# EAGLE design sensors (EAGLE 7.2.0)
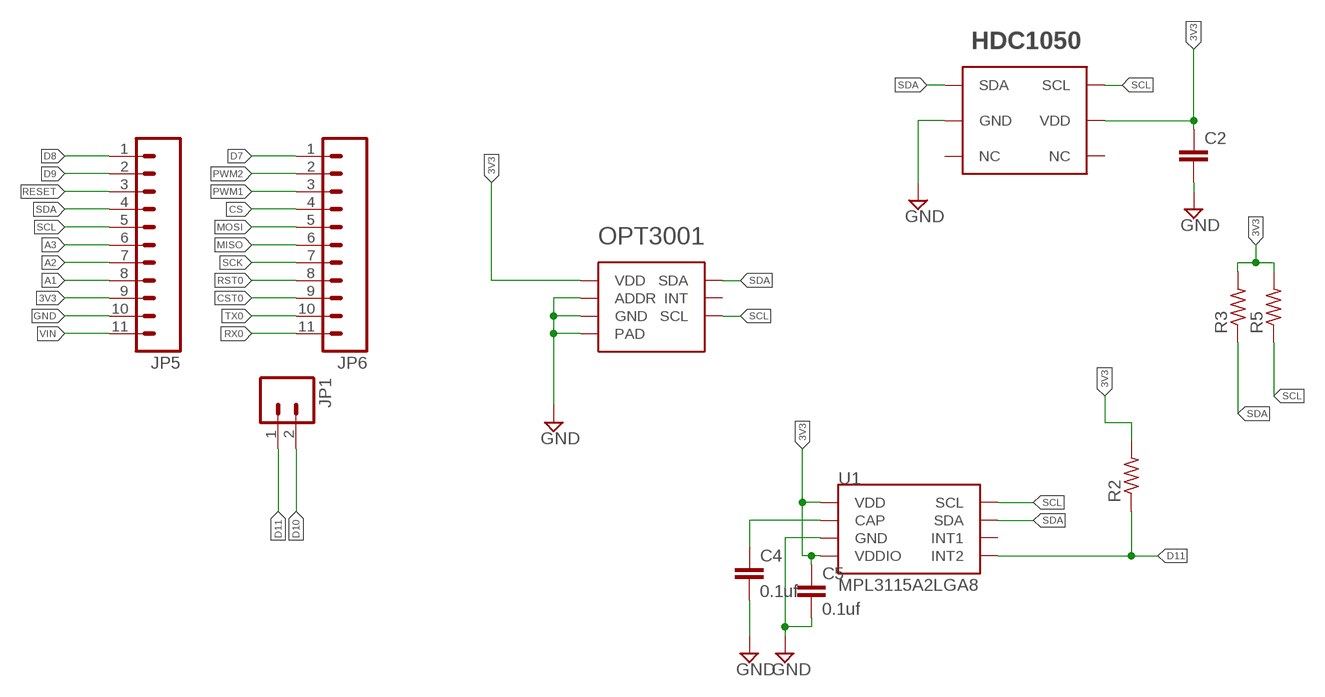
[diagram p0: schematic, sheet 1]

## Parts
C2  C-EUC0805  [C0805]
C4  0.1uf  C-EUC0805  [C0805]
C5  0.1uf  C-EUC0805  [C0805]
HDC1050  HDC1050  [PWSON-6]
JP1  M02PTH  [1X02]
JP5  M11PTH  [1X11]
JP6  M11PTH  [1X11]
OPT3001  OPT3001  [OPT3001]
R2  R-US_0204/5  [0204/5]
R3  R-US_0204/5  [0204/5]
R5  R-US_0204/5  [0204/5]
U1  MPL3115A2LGA8  [LGA8]

## Nets
3V3: C2.1 C5.1 HDC1050.P$5(VDD) JP5.9 OPT3001.P$1(VDD) R2.2 R3.2 R5.2 U1.1(VDD) U1.4(VDDIO)
A1: JP5.8
A2: JP5.7
A3: JP5.6
CS: JP6.4
CST0: JP6.9
D7: JP6.1
D8: JP5.1
D9: JP5.2
D10: JP1.2
D11: JP1.1 R2.1 U1.5(INT2)
GND: C2.2 C4.2 C5.2 HDC1050.P$2(GND) JP5.10 OPT3001.P$2(ADDR) OPT3001.P$3(GND) OPT3001.P$7(PAD) U1.3(GND)
MISO: JP6.6
MOSI: JP6.5
N$5: C4.1 U1.2(CAP)
PWM1: JP6.3
PWM2: JP6.2
RESET: JP5.3
RST0: JP6.8
RX0: JP6.11
SCK: JP6.7
SCL: HDC1050.P$6(SCL) JP5.5 OPT3001.P$4(SCL) R5.1 U1.8(SCL)
SDA: HDC1050.P$1(SDA) JP5.4 OPT3001.P$6(SDA) R3.1 U1.7(SDA)
TX0: JP6.10
VIN: JP5.11
Unconnected: HDC1050.P$3(NC) HDC1050.P$4(NC) OPT3001.P$5(INT) U1.6(INT1)

## Library data of the parts
C2 C4 C5 = rcl:C-EU: CAPACITOR, European symbol
HDC1050 = hdc1050:HDC1050: HDC1050 - Digital Humidity Sensor Technical Specifications: VCC: 2.7 - 5.5V Relative Humidity Accuracy ±3% Temperature Accuracy ±0.2°C Max Resolution: 14 bit Interface:I2C Operating Temperat ure: -40°C t o 125 °C Avg Current:710 nA @ 1sps, 11 bit RH Measurement 1.3 µA @ 1sps, 11 bit RH and Temperature 100 nA Sleep Mode Current
JP1 = SparkFun-Connectors:M02: Standard 2-pin 0.1" header. Use with - straight break away headers ( PRT-00116) - right angle break away headers (PRT-00553) - swiss pins (PRT-00743) - machine pins (PRT-00117) - female headers (PRT-00115) Molex polarized connector foot print use with: PRT-08233 with associated crimp pins and housings. 2.54_SCREWTERM for use with PRT-10571. 3.5mm Screw Terminal footprints for PRT-08084 5mm Screw Terminal footprints for use with PRT-08432
JP5 JP6 = SparkFun-Connectors:M11: Header 11 Standard 11-pin 0.1" header. Use with straight break away headers (SKU : PRT-00116), right angle break away headers (PRT-00553), swiss pins (PRT-00743), machine pins (PRT-00117), and female headers (PRT-00115).
OPT3001 = my_own:OPT3001: OPT3001-Ambient Light Sensor Technical Specifications: VDD: 1.6 to 3.6V 5.5V tolerant I/O Operating Temp: -40 to 85C Package: USON-6
R2 R3 R5 = resistor:R-US_: RESISTOR, American symbol
U1 = SparkFun-Sensors:MPL3115A2: Altimeter/Pressure Sensor, I2C, 1.95V-3.6V supply, 50 to 110kPa; PROD_ID: IC-10869

## Net classes
0 default: width 0.406 mm, drill 0.6 mm, clearance 0.305 mm

## Board
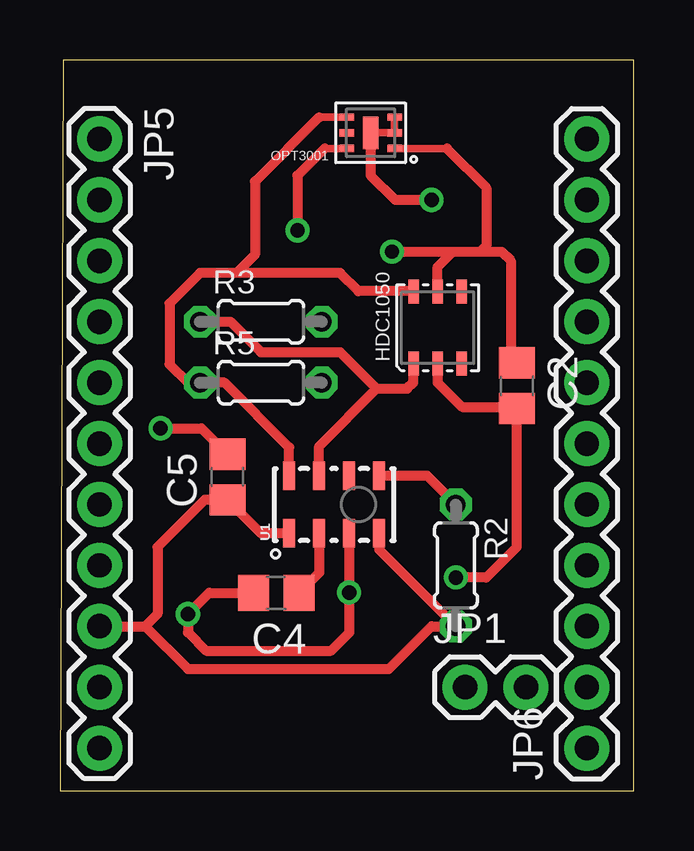
[diagram p1: board, top side]
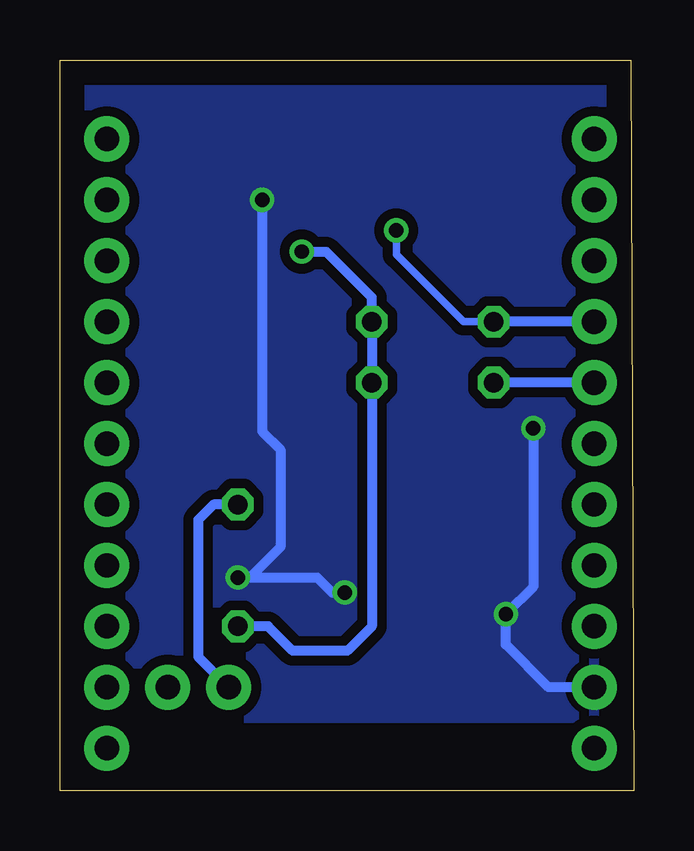
[diagram p2: board, bottom side, seen from below]

Size 23.93 x 30.47 mm. Coordinates in mm from the lower left corner, seen from the top.
Outline: 0,0 23.93,0 23.93,30.47 0.13,30.47 0,0
Copper layers (1*16): Top 0.035mm / dielectric 1.5mm / Bottom 0.035mm
Design rules "default": minimum track width 10mil, minimum drill 24mil, track to track 8mil, track to pad 8mil, pad to pad 8mil, via to via 8mil, smd to smd 8mil, copper to edge 40mil, drill to drill 8mil, minimum pad ring 10mil, minimum via ring 8mil, stop-mask expansion 4mil, vias tented up to drill 0mil, thermal gap 10mil

### Footprints (pad centres in the part's own frame; a part is rotated, then mirrored left to right if it is on the bottom)
C0805 = smd 1.3 x 1.5: 1 -0.95,0; 2 0.95,0
PWSON-6 = smd 1 x 0.45: P$1 -1.5,1; P$2 -1.5,0; P$3 -1.5,-1; P$4 1.5,-1; P$5 1.5,0; P$6 1.5,1
1X02 = drill 1.016 pad 1.88: 1 0,0; 2 2.54,0
1X11 = drill 1.016 pad 1.88: 1 0,0; 2 2.54,0; 3 5.08,0; 4 7.62,0; 5 10.16,0; 6 12.7,0; 7 15.24,0; 8 17.78,0; 9 20.32,0; 10 22.86,0; 11 25.4,0
OPT3001 = smd 0.61 x 0.305: P$1 -1,0.65; P$2 -1,0; P$3 -1,-0.65; P$4 1,-0.65; P$5 1,0; P$6 1,0.65 | smd 0.65 x 1.35: P$7 0,0
0204/5 = drill 0.813 octagon: 1 -2.54,0; 2 2.54,0
LGA8 = smd 1.2 x 0.5: 1 -1.2,1.875; 2 -1.2,0.625; 3 -1.2,-0.625; 4 -1.2,-1.875; 5 1.2,-1.875; 6 1.2,-0.625; 7 1.2,0.625; 8 1.2,1.875

### Placement (x,y rotation side)
C2  19.05,16.89 270 top
C4  9.02,8.25 180 top
C5  6.99,13.08 90 top
HDC1050  15.75,19.3 90 top
JP1  16.89,4.32 0 top
JP5  1.65,27.18 270 top
JP6  21.97,1.78 90 top
OPT3001  12.95,27.43 180 top
R2  16.51,9.4 270 top
R3  8.38,19.56 0 top
R5  8.38,17.02 0 top
U1  11.43,11.94 90 top

### Tracks (layer width: path | path; a pad name or v marks a point on that pad's centre or on a via)
3V3  (via drill 0.6)
  Top 0.305: OPT3001.P$1 16.14,26.78
  Top 0.406: HDC1050.P$5 15.75,21.84 16.38,22.48 | v13.84,22.48 16.38,22.48 | U1.4 13.31,10.06 R2.2 15.49,6.86 13.72,5.08 5.33,5.08 3.56,6.86 | 16.14,26.78 17.78,25.15 17.78,22.73 17.53,22.48 | U1.1 8.38,10.74 C5.1 6.04,12.13 4.06,10.16 4.06,7.37 3.56,6.86 | 16.38,22.48 17.53,22.48 | 17.53,22.48 18.42,22.48 18.8,22.1 18.8,18.1 C2.1 | JP5.9 3.56,6.86
  Bottom 0.406: v13.84,22.48 12.83,22.48 10.92,20.57 R3.2 R5.2 10.92,6.86 11.94,5.84 14.22,5.84 15.24,6.86 R2.2
D11
  Top 0.406: U1.5 15.31,13.14 R2.1
  Bottom 0.406: R2.1 17.53,11.94 18.16,11.3 18.16,5.59 JP1.1
GND  (via drill 0.6)
  Top 0.305: OPT3001.P$3 OPT3001.P$2 OPT3001.P$7
  Top 0.406: HDC1050.P$2 15.75,17.02 16.76,16 18.99,16 C2.2 | v4.19,15.11 5.9,15.11 C5.2 | v16.51,8.89 17.78,8.89 19.05,10.16 C2.2 | 19.01,16 C2.2 | OPT3001.P$7 12.95,25.65 13.97,24.64 v15.49,24.64 | C4.2 6.22,8.25 v5.33,7.37 5.33,6.6 6.1,5.84 11.3,5.84 12.07,6.6 12.07,8.51 v12.06,8.27 U1.3
  Bottom 0.406: v4.19,15.11 4.19,8.51 v5.33,7.37 | v16.51,8.89 16,8.89 | 16,8.89 13.21,8.89 12.58,8.27 v12.06,8.27 | v15.49,24.64 15.49,14.99 14.73,14.22 14.73,10.16 16,8.89 | 5.21,7.49 v5.33,7.37 | JP5.10 3.56,4.32 5.33,6.1 v5.33,7.37
  pour Bottom (isolate 0.406): 1.02,29.72 22.86,29.72 22.86,3.05 1.02,3.05
N$5
  Top 0.406: U1.2 10.81,9.09 C4.1
SCL
  Top 0.305: OPT3001.P$4 10.81,28.08
  Top 0.406: U1.8 9.56,14.32 6.86,17.02 R5.1 5.33,17.02 4.57,17.78 4.57,20.32 5.84,21.59 7.37,21.59 | HDC1050.P$6 14.72,20.83 12.45,20.83 11.68,21.59 7.37,21.59 | 10.81,28.08 8.13,25.4 8.13,22.35 7.37,21.59
  Bottom 0.406: JP5.5 R5.1
SDA  (via drill 0.6)
  Top 0.305: OPT3001.P$6 11.03,26.78
  Top 0.406: R3.1 7.11,19.56 8.38,18.29 11.68,18.29 13.21,16.76 | 13.21,16.76 14.48,16.76 14.73,17.02 14.73,17.79 HDC1050.P$1 | U1.7 10.81,14.36 13.21,16.76 | 11.03,26.78 9.91,25.65 v9.91,23.37
  Bottom 0.305: v9.91,23.37 9.91,22.35 7.11,19.56 R3.1
  Bottom 0.406: JP5.4 R3.1